# EAGLE design ATX PSU Breakout Mini (EAGLE 7.1.0)
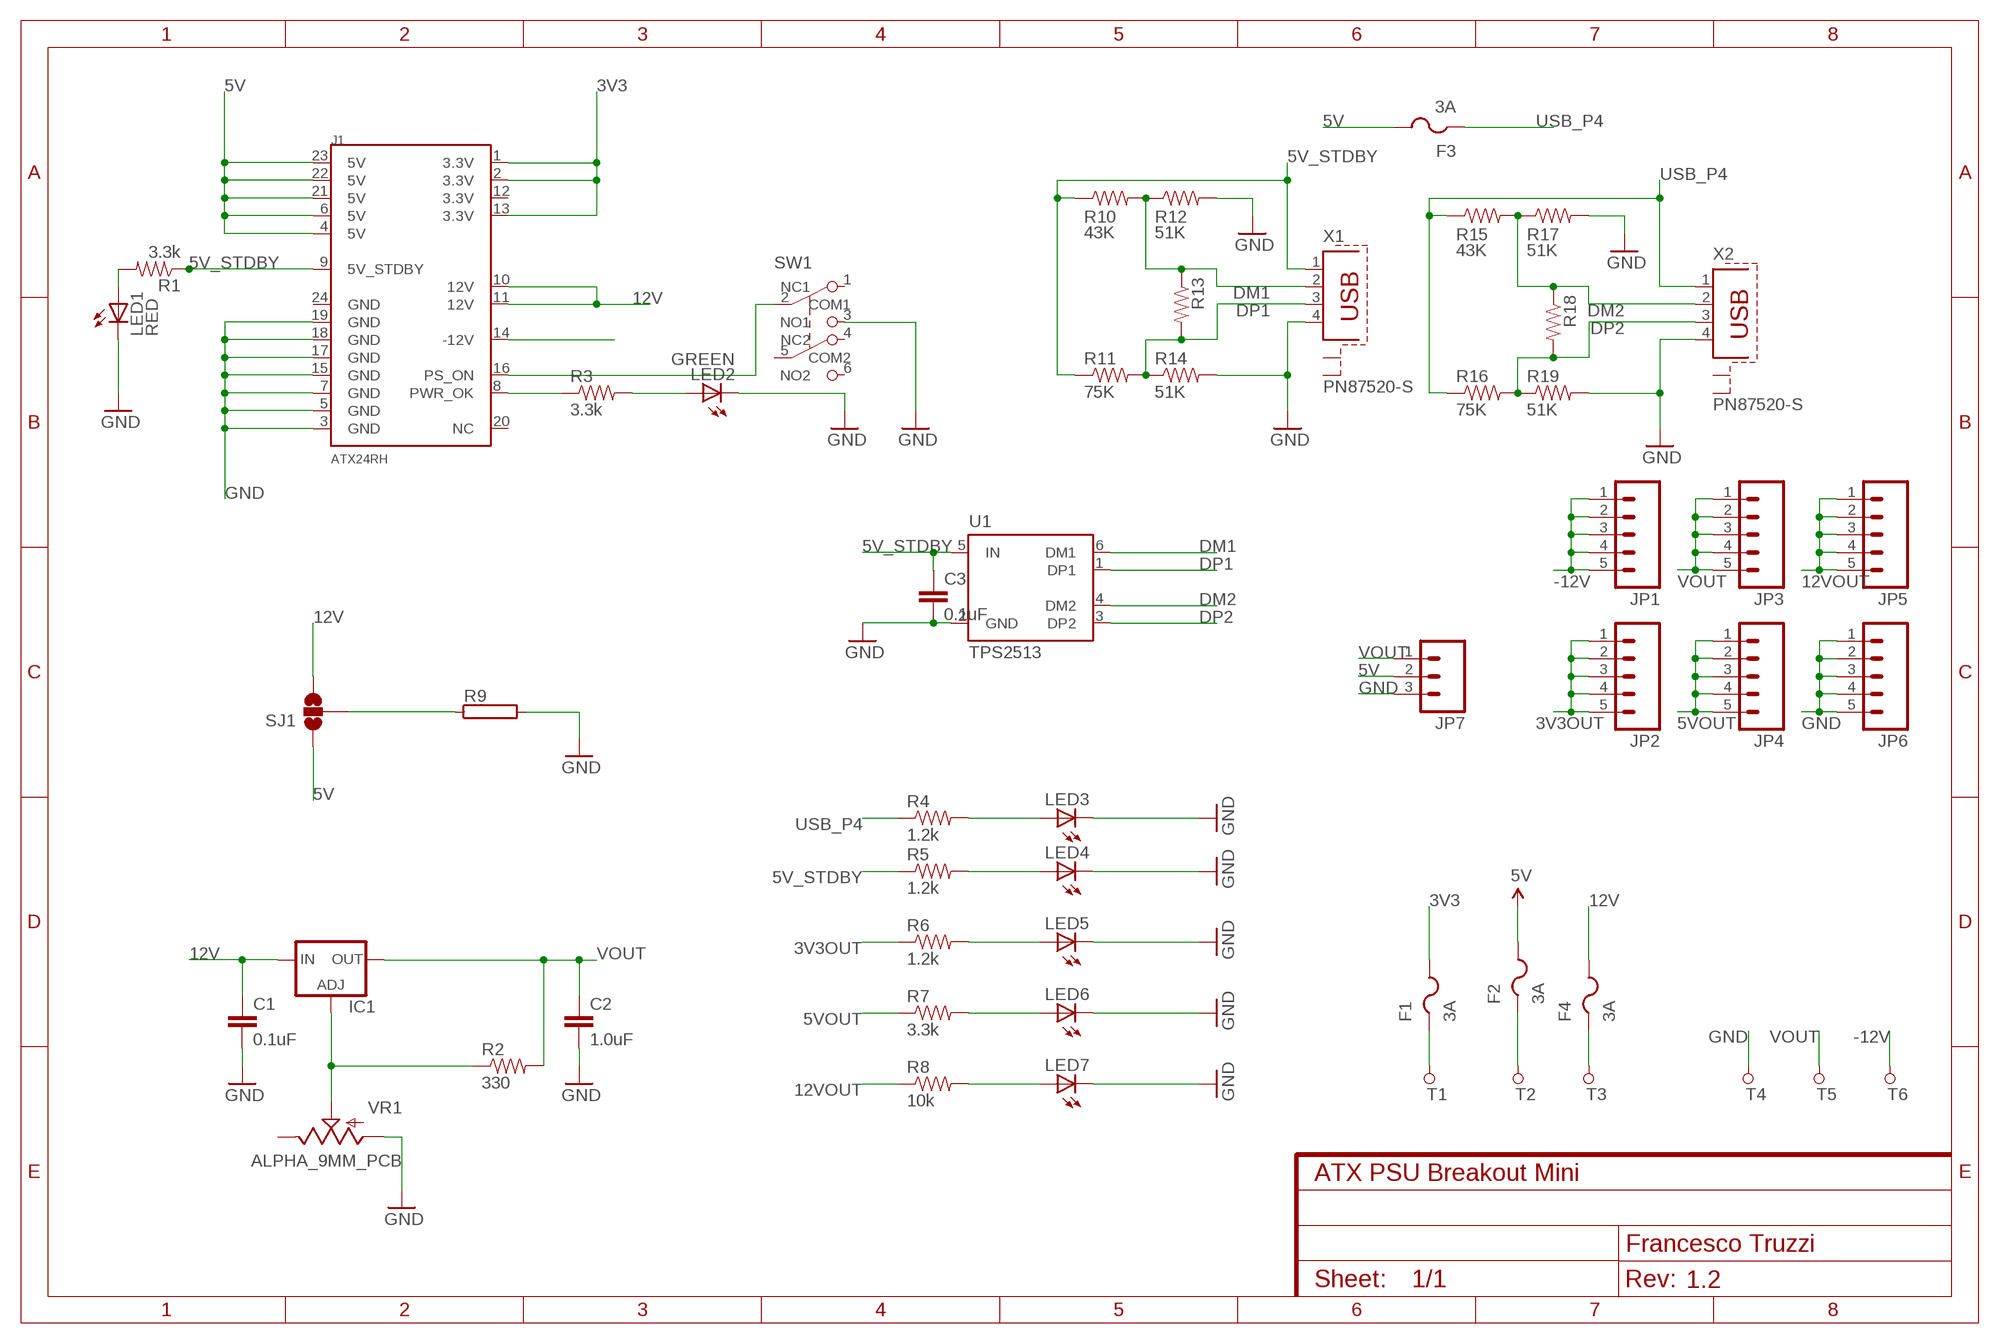
[diagram p0: schematic, sheet 1]
FRAME1 (FRAME-A4L): CNAME: ATX PSU Breakout Mini; CREVISION: 1.2; DESIGNER: Francesco Truzzi; LICENSE: Released under CC BY-NC-SA 4.0

## Parts
C1  0.1uF  1.0UF-25V-+80/-20(0805)  [0805]
C2  1.0uF  1.0UF-25V-+80/-20(0805)  [0805]
C3  0.1uF  1.0UF-25V-+80/-20(0805)  [0805]
F1  3A  PTCFUSE-1812  [1812]
F2  3A  PTCFUSE-1812  [1812]
F3  3A  PTCFUSE-1812  [1812]
F4  3A  PTCFUSE-1812  [1812]
IC1  LM317TL  [317TL]
J1  ATX24RH  [ATX24_RIGHT_ANGLE]
JP1  M05PTH  [1X05]
JP2  M05PTH  [1X05]
JP3  M05PTH  [1X05]
JP4  M05PTH  [1X05]
JP5  M05PTH  [1X05]
JP6  M05PTH  [1X05]
JP7  M03LOCK  [1X03_LOCK]
LED1  RED  LEDCHIPLED_0805  [CHIPLED_0805]
LED2  GREEN  LEDCHIPLED_0805  [CHIPLED_0805]
LED3  LEDCHIPLED_0805  [CHIPLED_0805]
LED4  LEDCHIPLED_0805  [CHIPLED_0805]
LED5  LEDCHIPLED_0805  [CHIPLED_0805]
LED6  LEDCHIPLED_0805  [CHIPLED_0805]
LED7  LEDCHIPLED_0805  [CHIPLED_0805]
R1  3.3k  RESISTOR0805-RES  [0805]
R2  330  RESISTOR0805-RES  [0805]
R3  3.3k  RESISTOR0805-RES  [0805]
R4  1.2k  RESISTOR0805-RES  [0805]
R5  1.2k  RESISTOR0805-RES  [0805]
R6  1.2k  RESISTOR0805-RES  [0805]
R7  3.3k  RESISTOR0805-RES  [0805]
R8  10k  RESISTOR0805-RES  [0805]
R9  RKH214-8  [KH214-8]
R10  43K  RESISTOR0805-RES  [0805]
R11  75K  RESISTOR0805-RES  [0805]
R12  51K  RESISTOR0805-RES  [0805]
R13  RESISTOR0805-RES  [0805]
R14  51K  RESISTOR0805-RES  [0805]
R15  43K  RESISTOR0805-RES  [0805]
R16  75K  RESISTOR0805-RES  [0805]
R17  51K  RESISTOR0805-RES  [0805]
R18  RESISTOR0805-RES  [0805]
R19  51K  RESISTOR0805-RES  [0805]
SJ1  SOLDERJUMPER_2WAYS  [SJ_3]
SW1  SW_PUSH_DPDT  [SW_PUSH_BUTTON_MINI]
T1  3V3  PAD_TERMINAL-4.1MMROUND  [PAD_ROUND_4.1MM]
T2  5V  PAD_TERMINAL-4.1MMROUND  [PAD_ROUND_4.1MM]
T3  12V  PAD_TERMINAL-4.1MMROUND  [PAD_ROUND_4.1MM]
T4  GND  PAD_TERMINAL-4.1MMROUND  [PAD_ROUND_4.1MM]
T5  ADJ  PAD_TERMINAL-4.1MMROUND  [PAD_ROUND_4.1MM]
T6  -12V  PAD_TERMINAL-4.1MMROUND  [PAD_ROUND_4.1MM]
U1  TPS2513  [SOT23-6]
VR1  ALPHA_9MM_PCB  [ALPHA_9MM_PCB]
X1  PN87520-S  [PN87520-S]
X2  PN87520-S  [PN87520-S]

## Nets
3V3: F1.2 J1.1(3.3V) J1.2(3.3V) J1.13(3.3V)
3V3OUT: F1.1 JP2.1 JP2.2 JP2.3 JP2.4 JP2.5 R6.1 T1.P
5V: F2.2 F3.2 J1.4(5V) J1.6(5V) J1.21(5V) J1.22(5V) J1.23(5V) JP7.2 SJ1.1
5V_STDBY: C3.1 J1.9(5V_STDBY) R1.1 R5.1 R10.1 R11.1 U1.5(IN) X1.1
5VOUT: F2.1 JP4.1 JP4.2 JP4.3 JP4.4 JP4.5 R7.1 T2.P
12V: C1.1 F4.2 IC1.3(IN) J1.10(12V) J1.11(12V) SJ1.3
12VOUT: F4.1 JP5.1 JP5.2 JP5.3 JP5.4 JP5.5 R8.1 T3.P
-12V: J1.14(-12V) JP1.1 JP1.2 JP1.3 JP1.4 JP1.5 T6.P
DM1: R10.2 R12.1 R13.1 U1.6(DM1) X1.2
DM2: R15.2 R17.1 R18.1 U1.4(DM2) X2.2
DP1: R11.2 R13.2 R14.1 U1.1(DP1) X1.3
DP2: R16.2 R18.2 R19.1 U1.3(DP2) X2.3
GND: C1.2 C2.2 C3.2 J1.3(GND) J1.5(GND) J1.7(GND) J1.15(GND) J1.17(GND) J1.18(GND) J1.19(GND) JP6.1 JP6.2 JP6.3 JP6.4 JP6.5 JP7.3 LED1.C LED2.C LED3.C LED4.C LED5.C LED6.C LED7.C R9.2 R12.2 R14.2 R17.2 R19.2 SW1.3(NO1) T4.P U1.2(GND) VR1.1(A) X1.4 X2.4
N$1: J1.8(PWR_OK) R3.1
N$2: LED2.A R3.2
N$7: R9.1 SJ1.2
N$9: IC1.1(ADJ) R2.1 VR1.2(S)
N$10: J1.16(PS_ON) SW1.2(COM1)
N$14: LED1.A R1.2
N$16: LED4.A R5.2
N$17: LED3.A R4.2
N$19: LED5.A R6.2
N$20: LED6.A R7.2
N$21: LED7.A R8.2
USB_P4: F3.1 R4.1 R15.1 R16.1 X2.1
VOUT: C2.1 IC1.2(OUT) JP3.1 JP3.2 JP3.3 JP3.4 JP3.5 JP7.1 R2.2 T5.P
Unconnected: J1.12(3.3V) J1.20(NC) J1.24(GND) SW1.1(NC1) SW1.4(NC2) SW1.5(COM2) SW1.6(NO2) VR1.3(E) X1.S1 X1.S2 X2.S1 X2.S2

## Library data of the parts
C1 C3 = SparkFun-Capacitors:1.0UF-25V-+80/-20(0805): CAP-11625; PROD_ID: CAP-11625; VALUE: 1.0uF
C2 = SparkFun-Capacitors:1.0UF-25V-+80/-20(0805): CAP-11625; PROD_ID: CAP-11625
F1-F4 = adafruit:PTCFUSE: PTC fuses, resettable thermistors
IC1 = v-reg:LM317TL: VOLTAGE REGULATOR
J1 = SparkFun-Connectors:ATX24: ATX24 Pin Power Supply Connector This is a good connector for connecting a computer power supply to a PCB. It's massive, but provides many amps of power at 5V and 12V. SKU: PRT-09498
JP1-JP6 = SparkFun-Connectors:M05: Header 5 Standard 5-pin 0.1" header. Use with straight break away headers (SKU : PRT-00116), right angle break away headers (PRT-00553), swiss pins (PRT-00743), machine pins (PRT-00117), and female headers (PRT-00115). Molex polarized connector foot print use with SKU : PRT-08230 with associated crimp pins and housings.
JP7 = SparkFun-Connectors:M03: Header 3 Standard 3-pin 0.1" header. Use with straight break away headers (SKU : PRT-00116), right angle break away headers (PRT-00553), swiss pins (PRT-00743), machine pins (PRT-00117), and female headers (PRT-00115). Molex polarized connector foot print use with SKU : PRT-08232 with associated crimp pins and housings.
LED1-LED7 = adafruit:LED: LED OSRAM: - CHIPLED LG R971, LG N971, LY N971, LG Q971, LY Q971, LO R971, LY R971 LH N974, LH R974 LS Q976, LO Q976, LY Q976 LO Q996 - Hyper CHIPLED LW Q18S LB Q993, LB Q99A, LB R99A - SideLED LS A670, LO A670, LY A670, LG A670, LP A670 LB A673, LV A673, LT A673, LW A673 LH A674 LY A675 LS A676, LA A676, LO A676, LY A676, LW A676 LS A679, LY A679, LG A679 - Hyper Micro SIDELED® LS Y876, LA Y876, LO Y876, LY Y876 LT Y87S - SmartLED LW L88C, LW L88S LB L89C, LB L89S, LG L890 LS L89K, LO L89K, LY L89K LS L896, LA L896, LO L896, LY L896 - TOPLED LS T670, LO T670, LY T670, LG T670, LP T670 LSG T670, LSP T670, LSY T670, LOP T670, LYG T670 LG T671, LOG T671, LSG T671 LB T673, LV T673, LT T673, LW T673 LH T674 LS T676, LA T676, LO T676, LY T676, LB T676, LH T676, LSB T676, LW T676 LB T67C, LV T67C, LT T67C, LS T67K, LO T67K, LY T67K, LW E67C LS E67B, LA E67B, LO E67B, LY E67B, LB E67C, LV E67C, LT E67C LW T67C LS T679, LY T679, LG T679 LS T770, LO T770, LY T770, LG T770, LP T770 LB T773, LV T773, LT T773, LW T773 LH T774 LS E675, LA E675, LY E675, LS T675 LS T776, LA T776, LO T776, LY T776, LB T776 LHGB T686 LT T68C, LB T68C - Hyper Mini TOPLED® LB M676 - Mini TOPLED Santana® LG M470 LS M47K, LO M47K, LY M47K Source: http://www.osram.convergy.de/
R1-R8 R10-R19 = SparkFun-Resistors:RESISTOR: Resistor Basic schematic elements and footprints for 0603, 1206, and PTH resistors.
R9 = resistor-power:R: Power Resitor; OC_FARNELL: unknown; OC_NEWARK: unknown
SJ1 = SparkFun-Retired:SOLDERJUMPER_2WAY: Solder Jumper 2 way solder jumper
SW1 = dp_devices.v6:SW_PUSH_DPDT
T1-T6 = dp_devices:PAD_TERMINAL: Terminal connection pad
U1 = SparkFun-DigitalIC:TPS2513
VR1 = Fra:ALPHA_9MM_PCB
X1 X2 = con-berg:PN87520-S; OC_FARNELL: unknown; OC_NEWARK: unknown

## Board
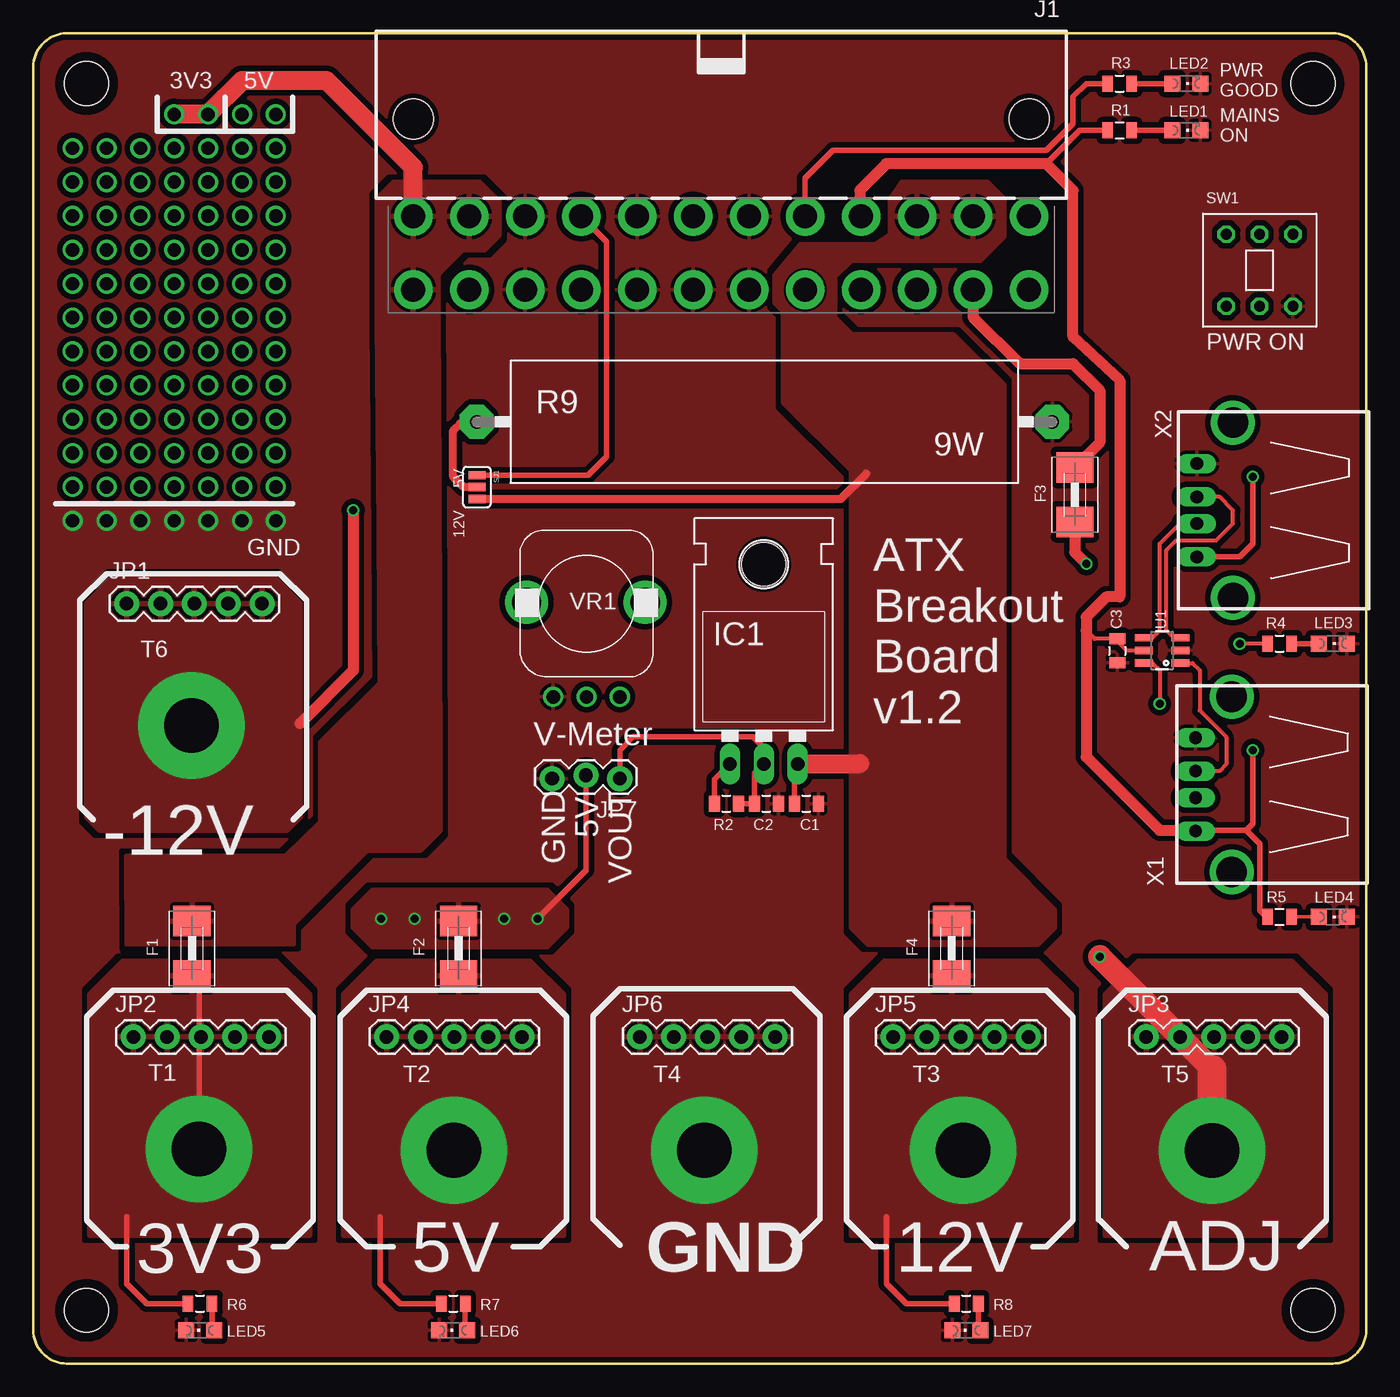
[diagram p1: board, top side]
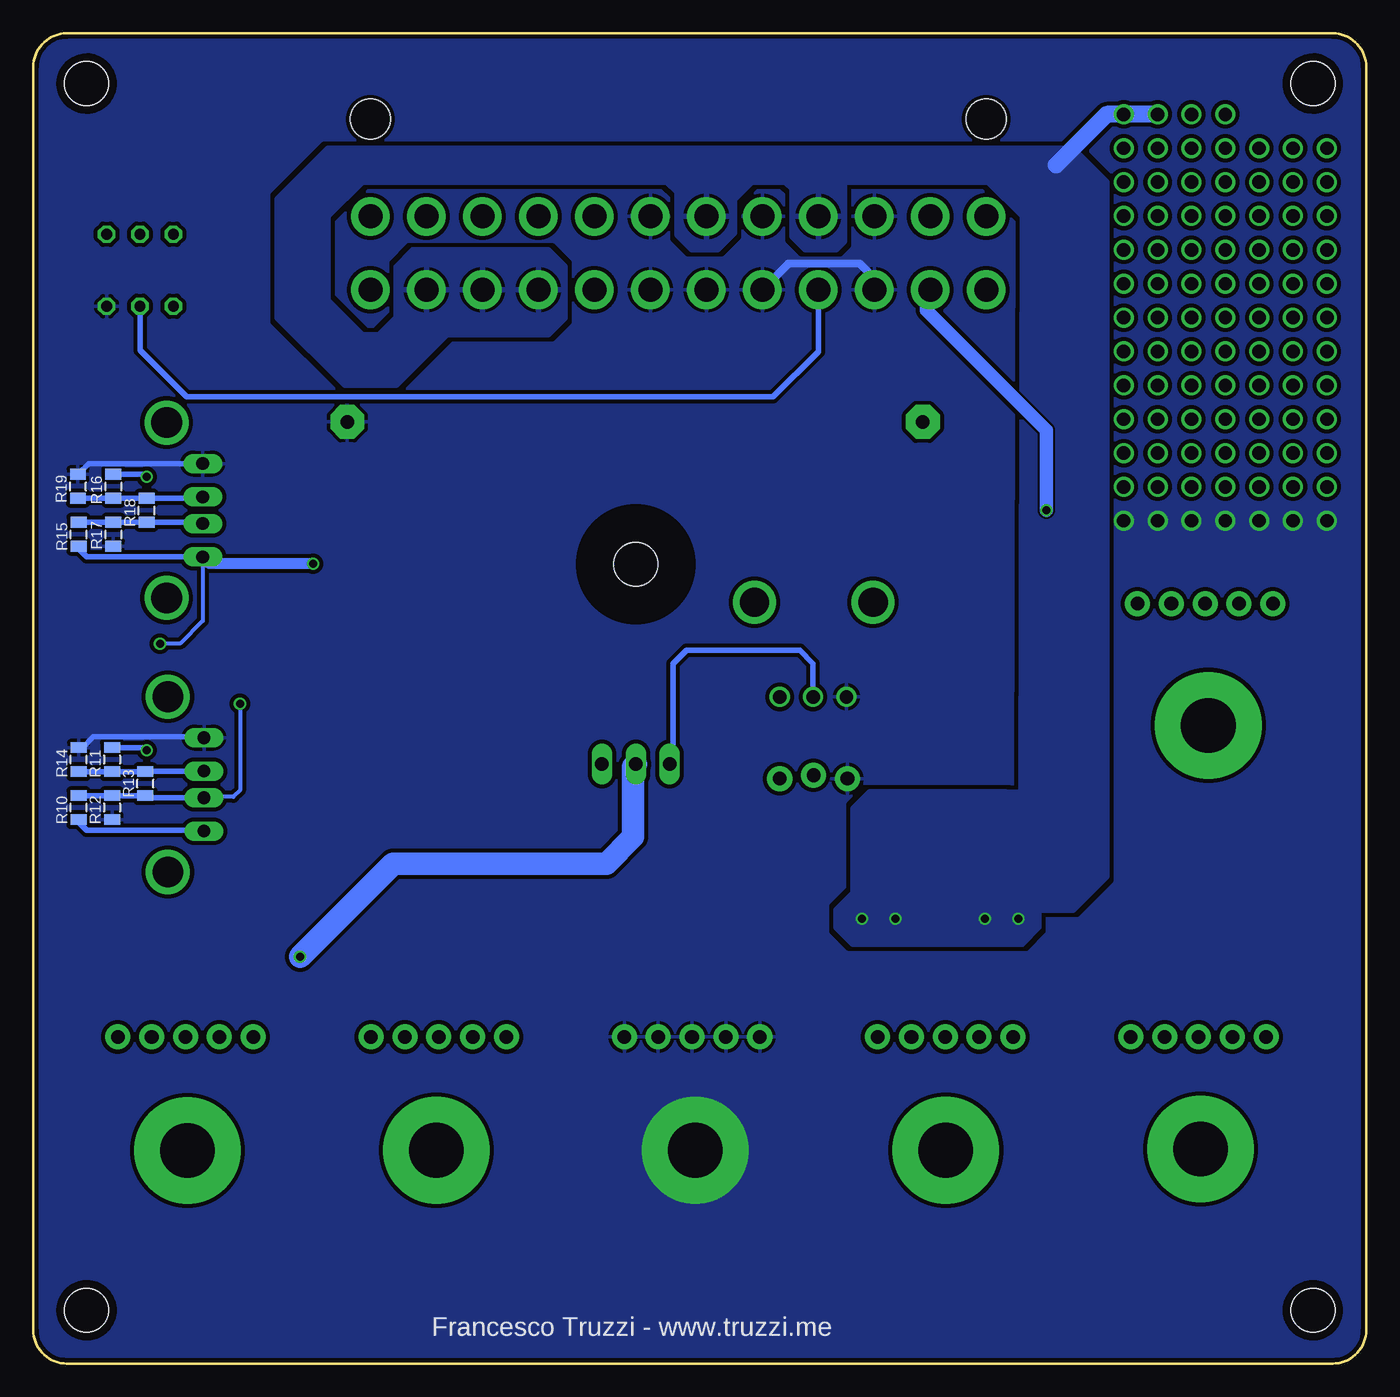
[diagram p2: board, bottom side, seen from below]

Size 100 x 99.77 mm. Coordinates in mm from the lower left corner, seen from the top.
Outline: 2.5,99.77 97.5,99.77 arc-90 100,97.27 100,2.5 arc-90 97.5,0 2.5,0 arc-90 0,2.5 0,97.27 arc-90 2.5,99.77
Copper layers (1*16): Top 0.035mm / dielectric 1.5mm / Bottom 0.035mm
Design rules "MakerStudio": minimum track width 6mil, minimum drill 12mil, track to track 6mil, track to pad 6mil, pad to pad 6mil, via to via 6mil, smd to smd 0mil, copper to edge 10mil, drill to drill 10mil, minimum pad ring 10mil, minimum via ring 6mil, stop-mask expansion 2mil, vias tented up to drill 100mil, thermal gap 10mil
tKeepout: area 6.9,10.6 to 17.9,21.6; area 44.9,10.5 to 55.9,21.5; area 64.3,10.5 to 75.3,21.5; area 26,10.5 to 37,21.5; area 82.9,10.5 to 93.9,21.5; area 6.4,42.4 to 17.4,53.4

### Footprints (pad centres in the part's own frame; a part is rotated, then mirrored left to right if it is on the bottom)
0805 = smd 0.8 x 1.2: 1 -0.9,0; 2 0.9,0
1812 = smd 2.286 x 2.794: 1 -2.046,0; 2 2.046,0
317TL = drill 1.016 long: 1 -2.54,-3.81; 2 0,-3.81; 3 2.54,-3.81 | hole 3.302: 0,11.176
ATX24_RIGHT_ANGLE = drill 1.8 pad 2.9: 1 23.1,4.76; 2 18.9,4.76; 3 14.7,4.76; 4 10.5,4.76; 5 6.3,4.76; 6 2.1,4.76; 7 -2.1,4.76; 8 -6.3,4.76; 9 -10.5,4.76; 10 -14.7,4.76; 11 -18.9,4.76; 12 -23.1,4.76; 13 23.1,10.26; 14 18.9,10.26; 15 14.7,10.26; 16 10.5,10.26; 17 6.3,10.26; 18 2.1,10.26; 19 -2.1,10.26; 20 -6.3,10.26; 21 -10.5,10.26; 22 -14.7,10.26; 23 -18.9,10.26; 24 -23.1,10.26 | hole 3: -23.1,-2.54; 23.1,-2.54
1X05 = drill 1.016 pad 1.88: 1 0,0; 2 2.54,0; 3 5.08,0; 4 7.62,0; 5 10.16,0
1X03_LOCK = drill 1.016 pad 1.88: 1 0,0.127; 2 2.54,-0.127; 3 5.08,0.127
CHIPLED_0805 = smd 1.2 x 1.2: A 0,-1.05; C 0,1.05
KH214-8 = drill 1.016 pad 2.54 octagon: 1 -21.59,0; 2 21.59,0
SJ_3 = smd 0.635 x 1.27: 1 -0.889,0; 2 0,0; 3 0.889,0
SW_PUSH_BUTTON_MINI = drill 0.8 octagon: 1 2.5,2.7; 2 0,2.7; 3 -2.5,2.7; 4 2.5,-2.7; 5 0,-2.7; 6 -2.5,-2.7
PAD_ROUND_4.1MM = drill 4.1 pad 8: P 0,0
SOT23-6 = smd 0.55 x 1.35: 1 -0.95,-1.375; 2 0,-1.375; 3 0.95,-1.375; 4 0.95,1.375; 5 0,1.375; 6 -0.95,1.375
STAND-OFF = hole 3.302: 0,0
ALPHA_9MM_PCB = drill 1: 1 -2.5,-4; 2 0,-4; 3 2.5,-4 | drill 2.2: P$1 -4.5,3.1; P$2 4.4,3.1
PN87520-S = drill 0.95 long: 1 -3.5,2.71; 2 -1,2.71; 3 1,2.71; 4 3.5,2.71 | drill 2.3 pad 2.9: S1 -6.57,0; S2 6.57,0

### Placement (x,y rotation side)
C1  58,42 0 top
C2  55,42 0 top
C3  81.32,53.46 270 top
F1  11.9,31.14 90 top
F2  31.9,31.14 90 top
F3  78.14,65.17 90 top
F4  68.9,31.14 90 top
IC1  54.8,48.78 0 top
J1  51.61,90.8 180 top
JP1  7,57 0 top
JP2  7.5,24.5 0 top
JP3  83.5,24.5 0 top
JP4  26.5,24.5 0 top
JP5  64.5,24.5 0 top
JP6  45.5,24.5 0 top
JP7  44,44 180 top
LED1  86.5,92.5 270 top
LED2  86.5,96 270 top
LED3  97.5,54 270 top
LED4  97.5,33.5 270 top
LED5  12.5,2.5 90 top
LED6  31.5,2.5 90 top
LED7  70,2.5 90 top
R1  81.5,92.5 0 top
R2  52,42 0 top
R3  81.5,96 0 top
R4  93.5,54 0 top
R5  93.5,33.5 0 top
R6  12.5,4.5 0 top
R7  31.5,4.5 0 top
R8  70,4.5 0 top
R9  54.85,70.63 0 top
R10  96.6,41.7 90 bottom
R11  94.1,45.3 270 bottom
R12  94.1,41.7 270 bottom
R13  91.6,43.5 90 bottom
R14  96.6,45.3 90 bottom
R15  96.6,62.2 90 bottom
R16  94,65.8 270 bottom
R17  94,62.2 270 bottom
R18  91.5,64 90 bottom
R19  96.65,65.8 90 bottom
SJ1  33.28,65.74 270 top
SW1  92,82 180 top
T1  12.43,16.1 0 top
T2  31.54,16 0 top
T3  69.77,16 0 top
T4  50.33,16 0 top
T5  88.44,15.99 0 top
T6  11.85,47.87 0 top
U1  84.68,53.49 90 top
U$1  [STAND-OFF]  96,96 0 top
U$2  [STAND-OFF]  96,4 0 top
U$3  [STAND-OFF]  4,4 0 top
U$4  [STAND-OFF]  4,96 0 top
VR1  41.5,54 0 top
X1  89.91,43.44 90 top
X2  90,64 90 top

### Tracks (layer width: path | path; a pad name or v marks a point on that pad's centre or on a via)
3V3  (via drill 1)
  Top 1.422: J1.1 28.51,89.72 22,96.23 15.65,96.23 v13.11,93.69 v10.57,93.69
  pour Top: 7.03,31.46 19.5,31.5 19.5,33 25,38.5 29,38.5 30.5,40 30.5,44 30.43,66.42 30.38,78.45 30.38,81.75 32.16,83.53 33.81,83.53 34.95,84.67 34.95,87.09 33.43,88.61 27.08,88.61 25.81,87.34 25.81,78.45 25.94,62.45 26,51 21.56,46.56 21.56,40.62 18.96,38.08 7.01,38.05
3V3OUT
  Top 0.406: F1.1 12.43,28.56 T1.P | R6.1 8.5,4.5 7,6 7,11
  pour Top: 4.22,9.64 20.73,9.64 20.73,27.65 18.19,30.19 6.76,30.19 4.22,27.65
5V  (via drill 0.6, 1)
  Top 0.406: J1.4 43,84.15 43,68 41.63,66.63 SJ1.1 | JP7.2 41.46,36.99 v37.84,33.37
  Top 0.813: J1.23 70.51,78.49 74,75 78,75 80,73 80,69.08 F3.2
  Bottom 1.27: 23.27,89.88 19.46,93.69 v18.19,93.69 v15.65,93.69
  other vias: 28.6,33.37 35.34,33.37 26.1,33.37
  pour Bottom: 39.14,89.25 39.14,84.16 39.78,83.53 42.07,83.53 43.08,84.55 43.08,88.1 43.59,88.61 46.13,88.61 47.4,87.34 47.4,84.8 48.67,83.53 50.58,83.53 51.72,84.67 51.72,87.85 52.48,88.61 75.34,88.61 77.88,86.07 77.88,79.72 75.34,77.18 74.07,77.18 72.8,78.45 72.8,82.26 71.53,83.53 61.37,83.53 60.1,82.26 60.1,78.45 61.37,77.18 68.99,77.18 72.8,73.37 76.61,73.37 81.69,78.45 81.69,87.34 77.88,91.15 41.05,91.15
  pour Bottom: 39.78,32.73 39.78,34 38.51,35.27 38.51,41.62 37.24,42.89 27.08,42.89 25.91,42.86 25.81,86.07 28.35,88.61 41.05,88.61 41.05,91.15 22,91.15 19.46,88.61 19.46,36.54 22,34 24.54,34 24.54,32.73 25.81,31.46 38.51,31.46
  pour Top: 25.5,35.5 38.5,35.5 40,34 40,32.75 38.5,31.25 25.5,31.25 24,32.75 24,34
5V_STDBY  (via drill 0.6)
  Top 0.305: 81.36,57.36 81.5,57.5 | U1.5 82,53.5 81.32,54.18 C3.1 79.64,54.36 79,55
  Top 0.406: v91.5,46 91.5,40.5 91,40 | R5.1 92.5,33.5 92,34 92,39 91,40 | 91,40 87.26,40 X1.1 | 76,90 78.5,92.5 R1.1
  Top 0.813: J1.9 62,86.15 62,88 64,90 76,90 78,88 78,77 81.5,73.75 81.5,57.5 80.5,57.5 79,56 79,55 79,45.5 84.5,40 87.14,40 X1.1
  Bottom 0.406: R11.1 91.7,46.2 v91.5,46 | R10.1 96.6,40.6 96,40 87.26,40 X1.1
5VOUT
  Top 0.406: R7.1 27.5,4.5 26,6 26,11
  pour Top: 23.27,9.64 39.78,9.64 39.78,27.65 37.24,30.19 25.81,30.19 23.27,27.65
12V
  Top 0.406: IC1.3 57.1,44.73 C1.1
  Top 0.61: SJ1.3 60.6,64.85 62.5,66.75
  Top 1.27: IC1.3 57.37,45
  Top 1.422: 57.37,45 62,45
  pour Top: 75.34,35.27 63.91,35.27 62.64,35.27 61.37,34 61.37,32.73 62.64,31.46 75.34,31.46 76.61,32.73 76.61,34
  pour Top: 64.29,84.67 64.29,87.34 65.18,88.61 71.53,88.61 72.8,87.34 72.8,84.55 71.02,82.77 61.37,82.77 60.1,81.5 60.1,78.45 61.37,77.18 68.99,77.18 72.8,73.37 72.8,37.81 76.61,34 76.61,32.73 75.34,31.46 62.64,31.46 61.37,32.73 61.37,67.02 56.29,72.1 56.29,78.96 55.66,79.59 55.66,81.62 57.56,83.91 63.15,83.91
12VOUT
  Top 0.406: R8.1 65.5,4.5 64,6 64,11
  pour Top: 61.37,9.64 77.88,9.64 77.88,27.65 75.34,30.19 63.91,30.19 61.37,27.65
-12V  (via drill 0.6)
  Top 0.813: v24,64 24,52 20,48
  Bottom 1.016: J1.14 33,80.25 33,79 24,70 v24,64
  pour Top: 4,57 6,59 18,59 20,57 20,41 19,40 5,40 4,41
DM1  (via drill 0.6)
  Top 0.305: U1.6 83.96,52.54 84.5,52 v84.5,49.5
  Bottom 0.305: v84.5,49.5 84.5,43 85,42.5 87.14,42.5 X1.2
  Bottom 0.406: X1.2 91.44,42.44 R13.1 R12.1 R10.2
DM2
  Top 0.305: U1.4 83.94,54.44 84.5,55 84.5,61.5 86,63 X2.2
  Bottom 0.406: R15.2 R17.1 R18.1 87.39,63.1 X2.2
DP1
  Top 0.305: U1.1 86.96,52.54 87.5,52 87.5,49 89.5,47 89.5,44.94 89,44.44 X1.3
  Bottom 0.406: X1.3 91.56,44.44 R13.2 R11.2 R14.1
DP2
  Top 0.305: X2.3 89,65 90,64 90,63 88.75,61.75 85.75,61.75 85,61 85,55 85.56,54.44 U1.3
  Bottom 0.406: R19.1 R16.2 R18.2 87.39,64.9 X2.3
GND  (via drill 1)
  Bottom 0.406: X2.4 95.85,67.5 R19.2 | R14.2 96.3,46.2 95.5,47 87.26,47 X1.4
  Bottom 0.61: J1.15 36.91,81.41 38,82.5 43.35,82.5 J1.17
  other vias: 18.19,63.21 15.65,63.21 13.11,63.21 10.57,63.21 8.03,63.21 5.49,63.21 2.95,63.21
  pour Top (isolate 0.406, rank 2): 97.5,0 2.5,0 arc-90 0,2.5 0,97.5 arc-90 2.5,100 97.5,100 arc-90 100,97.5 100,2.5 arc-90
  pour Top: 42.27,9.65 58.78,9.65 58.78,27.66 56.24,30.2 44.81,30.2 42.27,27.66
  pour Bottom (isolate 0.305, rank 2): 2.5,0 97.5,0 arc90 100,2.5 100,97.5 arc90 97.5,100 2.5,100 arc90 0,97.5 0,2.5 arc90
N$1
  Top 0.406: J1.8 57.91,88.91 60,91 76,91 78,93 78,95 79,96 R3.1
N$2
  Top 0.406: R3.2 LED2.A
N$3  (via drill 1)
  other vias: 2.95,91.15
N$4  (via drill 1)
  other vias: 5.49,91.15
N$5  (via drill 1)
  other vias: 8.03,91.15
N$6  (via drill 1)
  other vias: 10.57,91.15
N$7
  Top 0.406: 33.13,70.5 R9.1
  Top 0.61: SJ1.2 32.26,65.74 31.5,66.5 31.5,70 32,70.5 33.13,70.5
N$8  (via drill 1)
  other vias: 13.11,91.15
N$9
  Top 0.406: IC1.1 51.1,43.81 R2.1
  Bottom 0.406: VR1.2 41.5,52.5 42.5,53.5 51,53.5 52,52.5 52,45.23 IC1.1
N$10
  Bottom 0.406: J1.16 41.11,75.89 44.5,72.5 88.5,72.5 92,76 SW1.2
N$11  (via drill 1)
  other vias: 15.65,91.15
N$12  (via drill 1)
  other vias: 18.19,91.15
N$14
  Top 0.406: R1.2 LED1.A
N$15  (via drill 1)
  other vias: 18.19,88.61
N$16
  Top 0.254: LED4.A R5.2
N$17
  Top 0.406: R4.2 LED3.A
N$18  (via drill 1)
  other vias: 15.65,88.61
N$19
  Top 0.406: R6.2 13.4,2.65 LED5.A
N$20
  Top 0.406: R7.2 32.4,2.65 LED6.A
N$21
  Top 0.406: R8.2 70.9,2.65 LED7.A
N$22  (via drill 1)
  other vias: 13.11,88.61
N$23  (via drill 1)
  other vias: 10.57,88.61
N$24  (via drill 1)
  other vias: 8.03,88.61
N$25  (via drill 1)
  other vias: 5.49,88.61
N$26  (via drill 1)
  other vias: 2.95,88.61
N$27  (via drill 1)
  other vias: 2.95,86.07
N$28  (via drill 1)
  other vias: 2.95,83.53
N$29  (via drill 1)
  other vias: 2.95,80.99
N$30  (via drill 1)
  other vias: 2.95,78.45
N$31  (via drill 1)
  other vias: 2.95,75.91
N$32  (via drill 1)
  other vias: 2.95,73.37
N$33  (via drill 1)
  other vias: 2.95,70.83
N$34  (via drill 1)
  other vias: 2.95,68.29
N$35  (via drill 1)
  other vias: 2.95,65.75
N$43  (via drill 1)
  other vias: 18.19,65.75
N$44  (via drill 1)
  other vias: 15.65,65.75
N$45  (via drill 1)
  other vias: 13.11,65.75
N$46  (via drill 1)
  other vias: 10.57,65.75
N$47  (via drill 1)
  other vias: 8.03,65.75
N$48  (via drill 1)
  other vias: 5.49,65.75
N$49  (via drill 1)
  other vias: 5.49,68.29
N$50  (via drill 1)
  other vias: 5.49,83.53
N$51  (via drill 1)
  other vias: 8.03,86.07
N$52  (via drill 1)
  other vias: 8.03,83.53
N$53  (via drill 1)
  other vias: 10.57,83.53
N$54  (via drill 1)
  other vias: 10.57,86.07
N$55  (via drill 1)
  other vias: 13.11,86.07
N$56  (via drill 1)
  other vias: 13.11,83.53
N$57  (via drill 1)
  other vias: 15.65,83.53
N$58  (via drill 1)
  other vias: 15.65,86.07
N$59  (via drill 1)
  other vias: 18.19,86.07
N$60  (via drill 1)
  other vias: 18.19,83.53
N$61  (via drill 1)
  other vias: 18.19,80.99
N$62  (via drill 1)
  other vias: 18.19,78.45
N$63  (via drill 1)
  other vias: 18.19,75.91
N$64  (via drill 1)
  other vias: 18.19,73.37
N$65  (via drill 1)
  other vias: 18.19,70.83
N$66  (via drill 1)
  other vias: 18.19,68.29
N$67  (via drill 1)
  other vias: 15.65,68.29
N$68  (via drill 1)
  other vias: 15.65,70.83
N$69  (via drill 1)
  other vias: 15.65,73.37
N$70  (via drill 1)
  other vias: 15.65,75.91
N$71  (via drill 1)
  other vias: 15.65,78.45
N$72  (via drill 1)
  other vias: 15.65,80.99
N$73  (via drill 1)
  other vias: 13.11,80.99
N$74  (via drill 1)
  other vias: 10.57,80.99
N$75  (via drill 1)
  other vias: 8.03,80.99
N$76  (via drill 1)
  other vias: 5.49,80.99
N$77  (via drill 1)
  other vias: 5.49,78.45
N$78  (via drill 1)
  other vias: 8.03,78.45
N$79  (via drill 1)
  other vias: 10.57,78.45
N$80  (via drill 1)
  other vias: 13.11,78.45
N$81  (via drill 1)
  other vias: 13.11,75.91
N$82  (via drill 1)
  other vias: 10.57,75.91
N$83  (via drill 1)
  other vias: 8.03,75.91
N$84  (via drill 1)
  other vias: 5.49,75.91
N$85  (via drill 1)
  other vias: 5.49,73.37
N$86  (via drill 1)
  other vias: 8.03,73.37
N$87  (via drill 1)
  other vias: 10.57,73.37
N$88  (via drill 1)
  other vias: 13.11,73.37
N$89  (via drill 1)
  other vias: 13.11,70.83
N$90  (via drill 1)
  other vias: 10.57,70.83
N$91  (via drill 1)
  other vias: 8.03,70.83
N$92  (via drill 1)
  other vias: 5.49,70.83
N$93  (via drill 1)
  other vias: 8.03,68.29
N$94  (via drill 1)
  other vias: 10.57,68.29
N$95  (via drill 1)
  other vias: 13.11,68.29
N$96  (via drill 1)
  other vias: 5.49,86.07
USB_P4  (via drill 0.6)
  Top 0.305: R4.1 v90.5,54
  Top 0.406: v91.5,66.5 91.5,61.5 90.5,60.5 X2.1
  Top 0.813: F3.1 78.14,60.86 v79,60
  Bottom 0.305: X2.1 87.29,55.71 89,54 v90.5,54
  Bottom 0.406: R15.1 96.6,61.1 96,60.5 X2.1 | R16.1 91.7,66.7 v91.5,66.5
  Bottom 0.813: v79,60 86.79,60 X2.1
VOUT  (via drill 0.6)
  Top 0.406: R2.2 C2.1 54.1,44.27 IC1.2 55,45.17 55,46 54,47 45,47 44,46 JP7.1
  Top 1.778: 88.44,22.06 v80,30.5
  Top 2.184: T5.P 88.44,22.06
  Bottom 1.676: v80,30.5 73,37.5 57,37.5 55,39.5 55,44.77 IC1.2
  pour Top: 80.42,9.64 96.93,9.64 96.93,27.65 94.39,30.19 82.96,30.19 80.42,27.65

### Text on the board
tPlace: 3V3 | 5V | PWR / GOOD | MAINS / ON | PWR ON | 12V 5V | GND | ATX / Breakout / Board / v1.2 | V-Meter | 5V | GND | VOUT | -12V | 3V3 | 5V | GND | 12V | ADJ
bPlace: Francesco Truzzi - www.truzzi.me
200bmp: C:/Users/Fra/Desktop/Untitled-2.bmp | C:/Users/Fra/Desktop/Untitled-2.bmp | C:/Users/Fra/Desktop/Untitled-2.bmp | C:/Users/Fra/Desktop/Untitled-3.bmp